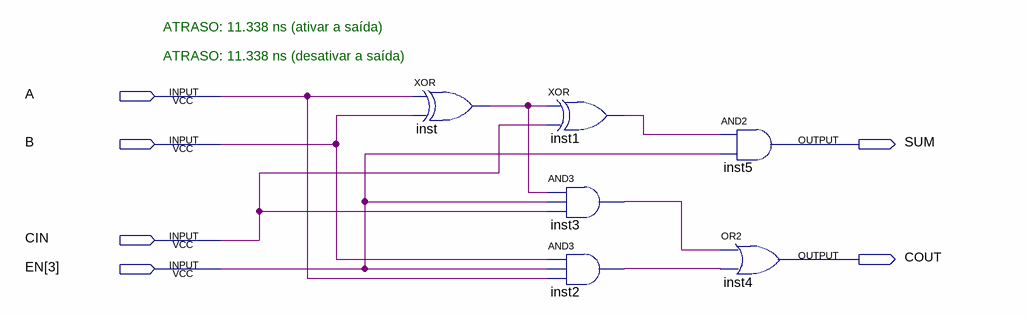
[diagram p0: schematic sheet]
// Quartus schematic full_adder_1bit_ula.bdf as structural Verilog: 6 symbols, 6 pins
module full_adder_1bit_ula (
  input  A,
  input  B,
  input  CIN,
  input  [3:3] EN,
  output SUM,
  output COUT
);

  wire inst1_out, inst2_out, inst3_out, inst_out;

  xor inst (inst_out, A, B);
  xor inst1 (inst1_out, inst_out, CIN);
  and inst3 (inst3_out, inst_out, EN[3], CIN);
  and inst2 (inst2_out, B, EN[3], A);
  and inst5 (SUM, inst1_out, EN[3]);
  or inst4 (COUT, inst3_out, inst2_out);

  // Notes on the sheet:
  //   ATRASO: 11.338 ns (ativar a saída)
  //   ATRASO: 11.338 ns (desativar a saída)
endmodule
